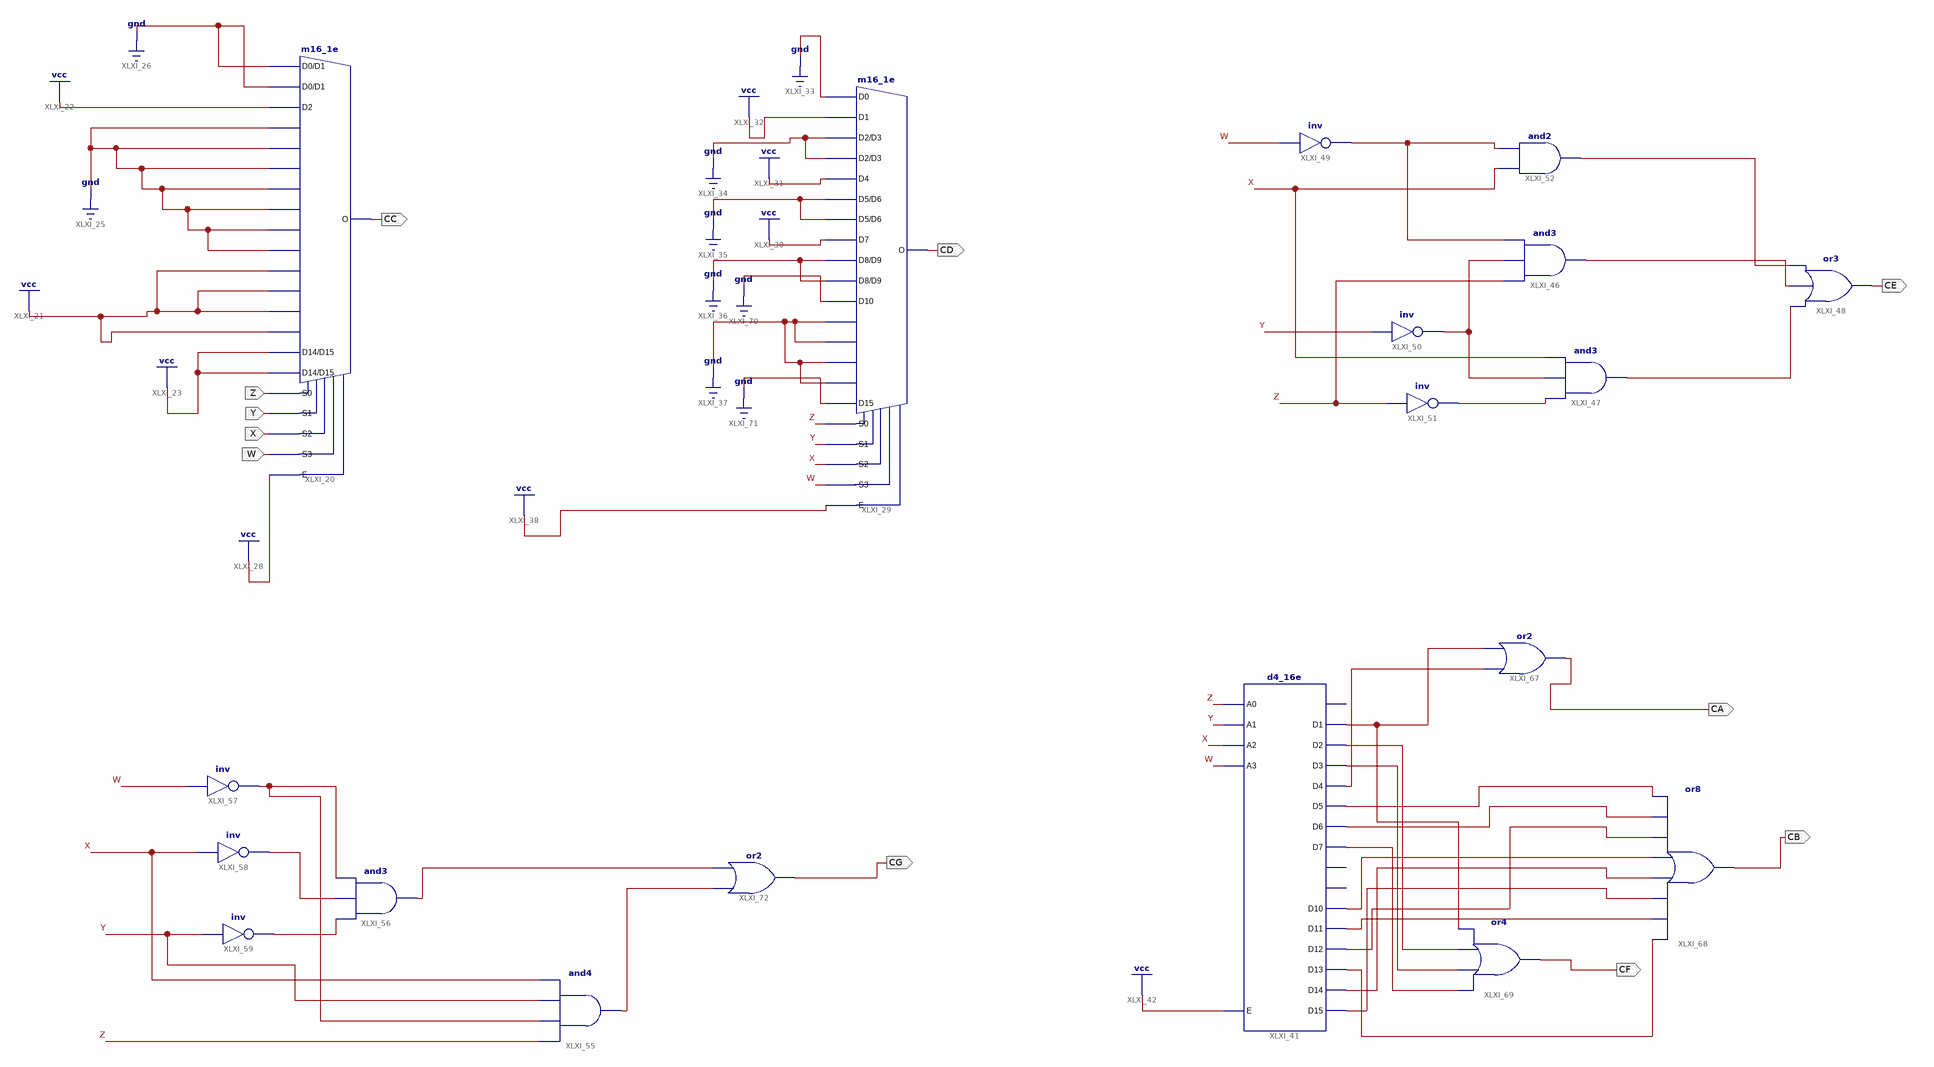
[diagram p0: schematic sheet 1]
// Xilinx ISE schematic Display_light.sch (spartan3e) as structural Verilog: 19 symbols, 11 ports
module Display_light (
  input  Y,
  input  X,
  input  W,
  input  Z,
  output CC,
  output CD,
  output CG,
  output CE,
  output CB,
  output CA,
  output CF
);

  wire XLXN_101, XLXN_108, XLXN_109, XLXN_110, XLXN_114, XLXN_119, XLXN_121, XLXN_123, XLXN_124, XLXN_125,
       XLXN_127, XLXN_132, XLXN_141, XLXN_142, XLXN_167, XLXN_168, XLXN_172, XLXN_173, XLXN_175, XLXN_176,
       XLXN_178, XLXN_192, XLXN_254, XLXN_255;

  m16_1e XLXI_20 (
    .D0(1'b0), .D1(1'b0), .D10(1'b1), .D11(1'b1), .D12(1'b1), .D13(1'b1), .D14(1'b1), .D15(1'b1), .D2(1'b1),
    .D3(1'b0), .D4(1'b0), .D5(1'b0), .D6(1'b0), .D7(1'b0), .D8(1'b0), .D9(1'b0), .E(1'b1), .S0(Z), .S1(Y),
    .S2(X), .S3(W), .O(CC));
  m16_1e XLXI_29 (
    .D0(1'b0), .D1(1'b1), .D10(1'b0), .D11(1'b0), .D12(1'b0), .D13(1'b0), .D14(1'b0), .D15(1'b0), .D2(1'b0),
    .D3(1'b0), .D4(1'b1), .D5(1'b0), .D6(1'b0), .D7(1'b1), .D8(1'b0), .D9(1'b0), .E(1'b1), .S0(Z), .S1(Y),
    .S2(X), .S3(W), .O(CD));
  and XLXI_55 (XLXN_142, Z, XLXN_127, Y, X);
  and XLXI_56 (XLXN_141, XLXN_192, XLXN_132, XLXN_127);
  not XLXI_57 (XLXN_127, W);
  not XLXI_58 (XLXN_132, X);
  not XLXI_59 (XLXN_192, Y);
  or XLXI_72 (CG, XLXN_142, XLXN_141);
  or XLXI_48 (CE, XLXN_125, XLXN_124, XLXN_123);
  not XLXI_50 (XLXN_119, Y);
  not XLXI_51 (XLXN_121, Z);
  and XLXI_52 (XLXN_123, X, XLXN_114);
  and XLXI_46 (XLXN_124, Z, XLXN_119, XLXN_114);
  and XLXI_47 (XLXN_125, XLXN_121, XLXN_119, X);
  not XLXI_49 (XLXN_114, W);
  d4_16e XLXI_41 (
    .A0(Z), .A1(Y), .A2(X), .A3(W), .E(1'b1), .D1(XLXN_167), .D10(XLXN_255), .D11(XLXN_254), .D12(XLXN_173),
    .D13(XLXN_178), .D14(XLXN_175), .D15(XLXN_176), .D2(XLXN_108), .D3(XLXN_109), .D4(XLXN_168),
    .D5(XLXN_101), .D6(XLXN_172), .D7(XLXN_110));  // open: D0, D8, D9
  or XLXI_67 (CA, XLXN_168, XLXN_167);
  or XLXI_68 (CB, XLXN_178, XLXN_254, XLXN_176, XLXN_175, XLXN_255, XLXN_173, XLXN_172, XLXN_101);
  or XLXI_69 (CF, XLXN_110, XLXN_109, XLXN_108, XLXN_167);

  // Notes on the sheet:
  //   LOC on signal CC = P40
  //   LOC on signal CD = P53
  //   LOC on signal CG = P62
  //   LOC on signal CE = P33
  //   LOC on signal CB = P65
  //   LOC on signal CA = P57
  //   LOC on signal CF = P35
endmodule
